# EAGLE design tablespoon-no-adc-backside (EAGLE 6.5.0)
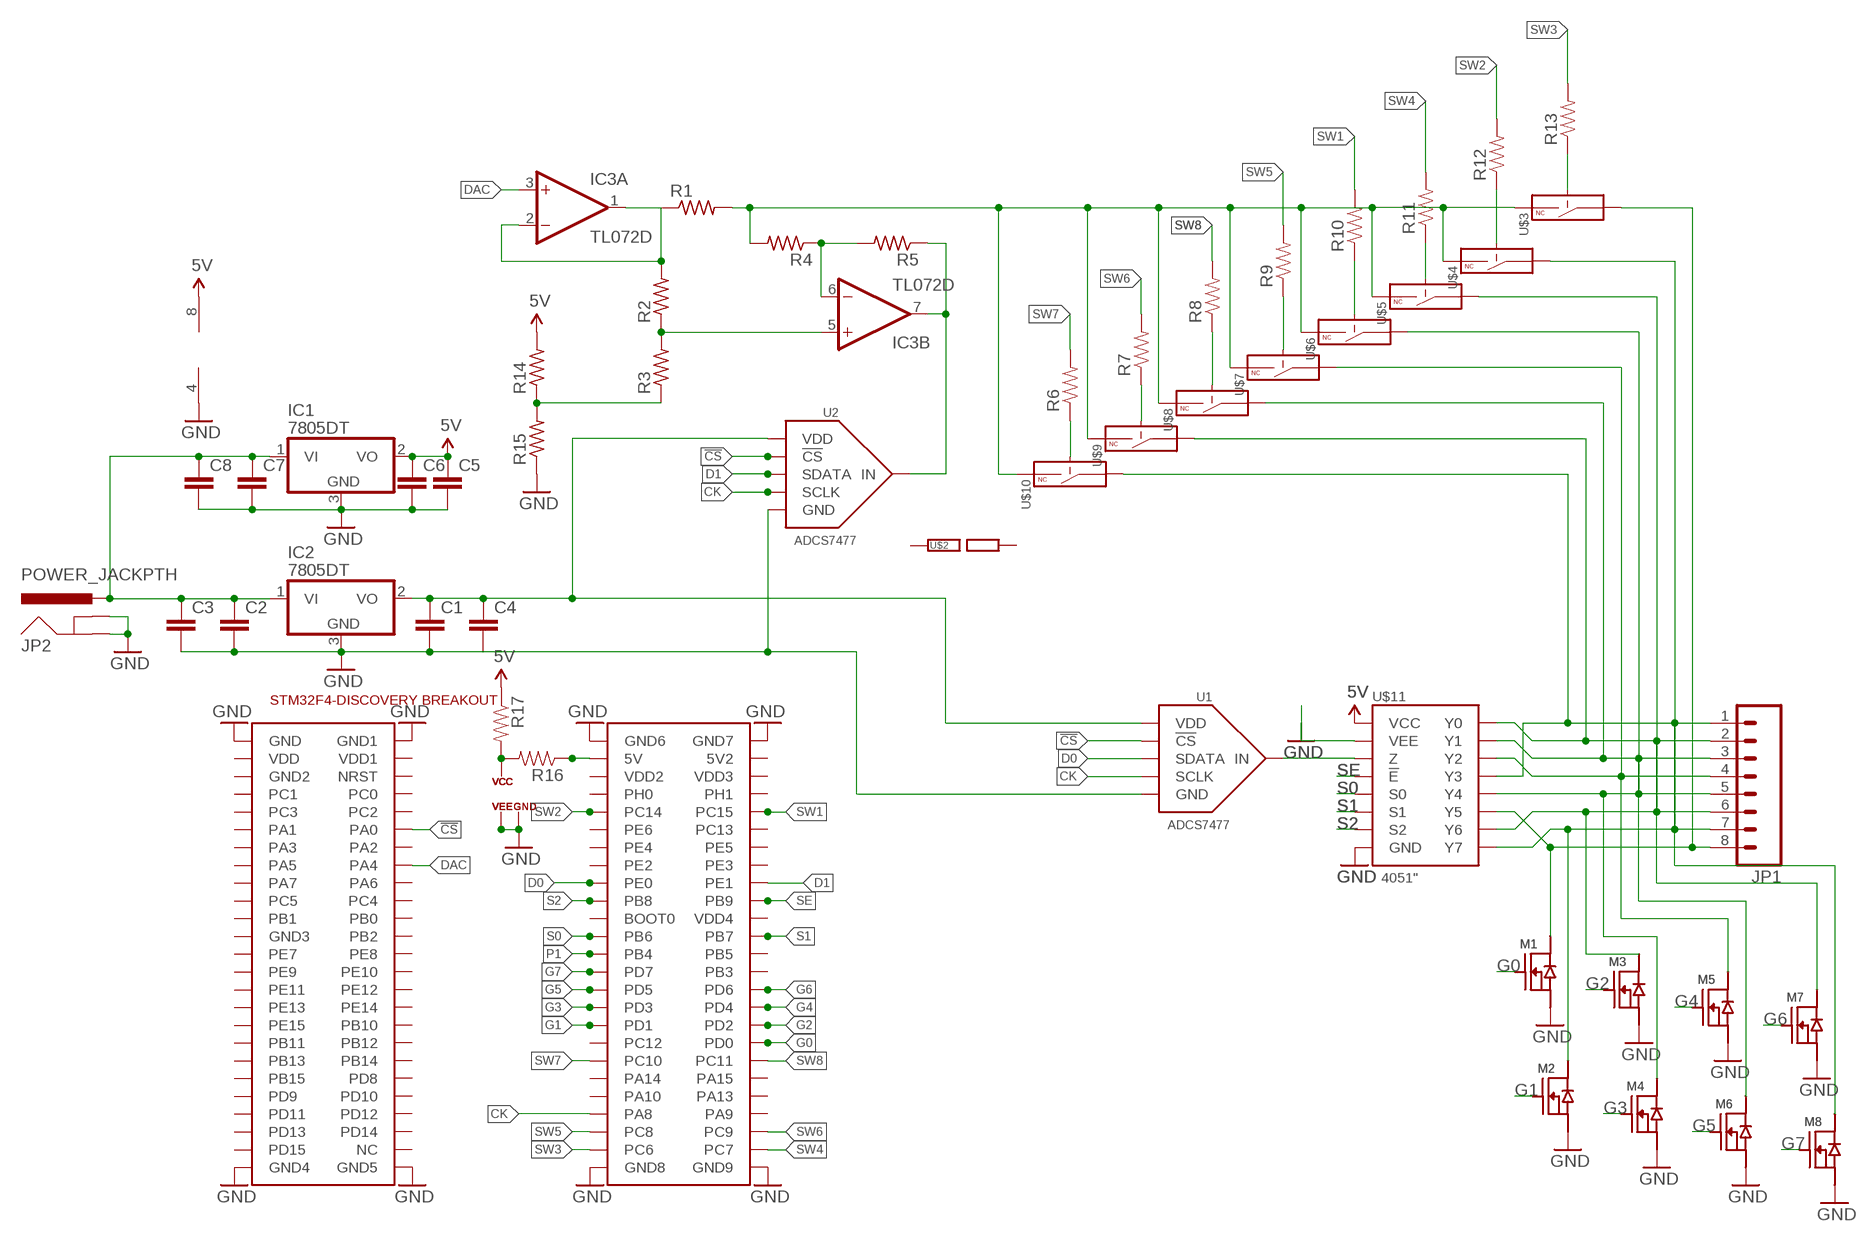
[diagram p0: schematic, sheet 1]

## Parts
C1  C-EUC0805  [C0805]
C2  C-EUC0805  [C0805]
C3  C-EUC0805  [C0805]
C4  C-EUC0805  [C0805]
C5  C-EUC0805  [C0805]
C6  C-EUC0805  [C0805]
C7  C-EUC0805  [C0805]
C8  C-EUC0805  [C0805]
IC1  7805DT  [TO252]
IC2  7805DT  [TO252]
IC3  TL072D  [SO08]
JP1  M08LONGPADS  [1X08_LONGPADS]
JP2  POWER_JACKPTH  [POWER_JACK_PTH]
M1  N-FET  [SOT23-3]
M2  N-FET  [SOT23-3]
M3  N-FET  [SOT23-3]
M4  N-FET  [SOT23-3]
M5  N-FET  [SOT23-3]
M6  N-FET  [SOT23-3]
M7  N-FET  [SOT23-3]
M8  N-FET  [SOT23-3]
R1  R-US_R0603  [R0603]
R2  R-US_R0603  [R0603]
R3  R-US_R0603  [R0603]
R4  R-US_R0603  [R0603]
R5  R-US_R0603  [R0603]
R6  RESISTOR0805-RES  [0805]
R7  RESISTOR0805-RES  [0805]
R8  RESISTOR0805-RES  [0805]
R9  RESISTOR0805-RES  [0805]
R10  RESISTOR0805-RES  [0805]
R11  RESISTOR0805-RES  [0805]
R12  RESISTOR0805-RES  [0805]
R13  RESISTOR0805-RES  [0805]
R14  R-US_R0603  [R0603]
R15  R-US_R0603  [R0603]
R16  RESISTOR0805-RES  [0805]
R17  RESISTOR0805-RES  [0805]
U1  ADCS7477  [SOT-23-6]
U2  ADCS7477  [SOT-23-6]
U$1  STM32F4-DISCOVERY  [STM32F4-DISCOVERY]
U$2  RAILSEP  [RAIL]
U$3  DG467  [TSSOP-6]
U$4  DG467  [TSSOP-6]
U$5  DG467  [TSSOP-6]
U$6  DG467  [TSSOP-6]
U$7  DG467  [TSSOP-6]
U$8  DG467  [TSSOP-6]
U$9  DG467  [TSSOP-6]
U$10  DG467  [TSSOP-6]
U$11  4051"  [TSSOP-16]

## Nets
4.6V: R16.1 U$1.P$53(5V)
5V: C5.1 C6.1 IC1.2(VO) IC3.8(P:V+) R14.2 R17.1 U$11.P$16(VCC)
!CS: U1.P$6(!CS) U2.P$6(!CS) U$1.P$12(PA0)
CK: U1.P$4(SCLK) U2.P$4(SCLK) U$1.P$93(PA8)
CUR: IC3.7(B:OUT) R5.1 U2.P$3(IN)
D0: U1.P$5(SDATA) U$1.P$67(PE0)
D1: U2.P$5(SDATA) U$1.P$68(PE1)
DAC: IC3.3(A:+IN) U$1.P$16(PA4)
G0: M1.1(G) U$1.P$86(PD0)
G1: M2.1(G) U$1.P$83(PD1)
G2: M3.1(G) U$1.P$84(PD2)
G3: M4.1(G) U$1.P$81(PD3)
G4: M5.1(G) U$1.P$82(PD4)
G5: M6.1(G) U$1.P$79(PD5)
G6: M7.1(G) U$1.P$80(PD6)
G7: M8.1(G) U$1.P$77(PD7)
GND: C1.2 C2.2 C3.2 C4.2 C5.2 C6.2 C7.2 C8.2 IC1.3(GND) IC2.3(GND) IC3.4(P:V-) JP2.GND JP2.GNDBREAK M1.2(S) M2.2(S) M3.2(S) M4.2(S) M5.2(S) M6.2(S) M7.2(S) M8.2(S) R15.1 U1.P$2(GND) U2.P$2(GND) U$1.P$1(GND) U$1.P$2(GND1) U$1.P$49(GND4) U$1.P$50(GND5) U$1.P$51(GND6) U$1.P$52(GND7) U$1.P$99(GND8) U$1.P$100(GND9) U$3.P$2(VEE) U$3.P$4(GND) U$4.P$2(VEE) U$4.P$4(GND) U$5.P$2(VEE) U$5.P$4(GND) U$6.P$2(VEE) U$6.P$4(GND) U$7.P$2(VEE) U$7.P$4(GND) U$8.P$2(VEE) U$8.P$4(GND) U$9.P$2(VEE) U$9.P$4(GND) U$10.P$2(VEE) U$10.P$4(GND) U$11.P$7(VEE) U$11.P$8(GND)
N$1: JP1.2 M7.3(D) U$9.P$6(COM) U$11.P$13(Y0)
N$2: C1.1 C4.1 IC2.2(VO) U1.P$1(VDD) U2.P$1(VDD)
N$4: R6.1 U$10.P$3(CTL)
N$5: C2.1 C3.1 C7.1 C8.1 IC1.1(VI) IC2.1(VI) JP2.PWR
N$6: JP1.3 M6.3(D) U$8.P$6(COM) U$11.P$14(Y1)
N$7: R7.1 U$9.P$3(CTL)
N$8: IC3.1(A:OUT) IC3.2(A:-IN) R1.1 R2.2
N$9: JP1.1 M8.3(D) U$10.P$6(COM) U$11.P$12(Y3)
N$13: IC3.5(B:+IN) R2.1 R3.2
N$14: IC3.6(B:-IN) R4.1 R5.2
N$15: R8.1 U$8.P$3(CTL)
N$16: R1.2 R4.2 U$3.P$1(IN) U$4.P$1(IN) U$5.P$1(IN) U$6.P$1(IN) U$7.P$1(IN) U$8.P$1(IN) U$9.P$1(IN) U$10.P$1(IN)
N$17: R9.1 U$7.P$3(CTL)
N$18: R12.1 U$4.P$3(CTL)
N$19: R13.1 U$3.P$3(CTL)
N$20: R11.1 U$5.P$3(CTL)
N$21: R10.1 U$6.P$3(CTL)
N$29: JP1.8 M1.3(D) U$3.P$6(COM) U$11.P$5(Y5)
N$35: R3.1 R14.1 R15.2
N$36: R16.2 R17.2 U$3.P$5(VCC) U$4.P$5(VCC) U$5.P$5(VCC) U$6.P$5(VCC) U$7.P$5(VCC) U$8.P$5(VCC) U$9.P$5(VCC) U$10.P$5(VCC)
N$37: U1.P$3(IN) U$11.P$3(Z)
N$38: JP1.7 M2.3(D) U$4.P$6(COM) U$11.P$4(Y7)
N$39: JP1.6 M3.3(D) U$5.P$6(COM) U$11.P$2(Y6)
N$40: JP1.5 M4.3(D) U$6.P$6(COM) U$11.P$1(Y4)
N$41: JP1.4 M5.3(D) U$7.P$6(COM) U$11.P$15(Y2)
P1: U$1.P$75(PB4)
S0: U$1.P$73(PB6) U$11.P$11(S0)
S1: U$1.P$74(PB7) U$11.P$10(S1)
S2: U$1.P$69(PB8) U$11.P$9(S2)
SE: U$1.P$70(PB9) U$11.P$6(!E)
SW1: R10.2 U$1.P$60(PC15)
SW2: R12.2 U$1.P$59(PC14)
SW3: R13.2 U$1.P$97(PC6)
SW4: R11.2 U$1.P$98(PC7)
SW5: R9.2 U$1.P$95(PC8)
SW6: R7.2 U$1.P$96(PC9)
SW7: R6.2 U$1.P$87(PC10)
SW8: R8.2 U$1.P$88(PC11)
Unconnected: U$1.P$3(VDD) U$1.P$4(VDD1) U$1.P$5(GND2) U$1.P$6(NRST) U$1.P$7(PC1) U$1.P$8(PC0) U$1.P$9(PC3) U$1.P$10(PC2) U$1.P$11(PA1) U$1.P$13(PA3) U$1.P$14(PA2) U$1.P$15(PA5) U$1.P$17(PA7) U$1.P$18(PA6) U$1.P$19(PC5) U$1.P$20(PC4) U$1.P$21(PB1) U$1.P$22(PB0) U$1.P$23(GND3) U$1.P$24(PB2) U$1.P$25(PE7) U$1.P$26(PE8) U$1.P$27(PE9) U$1.P$28(PE10) U$1.P$29(PE11) U$1.P$30(PE12) U$1.P$31(PE13) U$1.P$32(PE14) U$1.P$33(PE15) U$1.P$34(PB10) U$1.P$35(PB11) U$1.P$36(PB12) U$1.P$37(PB13) U$1.P$38(PB14) U$1.P$39(PB15) U$1.P$40(PD8) U$1.P$41(PD9) U$1.P$42(PD10) U$1.P$43(PD11) U$1.P$44(PD12) U$1.P$45(PD13) U$1.P$46(PD14) U$1.P$47(PD15) U$1.P$48(NC) U$1.P$54(5V2) U$1.P$55(VDD2) U$1.P$56(VDD3) U$1.P$57(PH0) U$1.P$58(PH1) U$1.P$61(PE6) U$1.P$62(PC13) U$1.P$63(PE4) U$1.P$64(PE5) U$1.P$65(PE2) U$1.P$66(PE3) U$1.P$71(BOOT0) U$1.P$72(VDD4) U$1.P$76(PB5) U$1.P$78(PB3) U$1.P$85(PC12) U$1.P$89(PA14) U$1.P$90(PA15) U$1.P$91(PA10) U$1.P$92(PA13) U$1.P$94(PA9) U$2.P$L(L) U$2.P$R(R)

## Library data of the parts
C1-C8 = rcl:C-EU: CAPACITOR, European symbol
IC1 IC2 = linear:78*: Positive VOLTAGE REGULATOR Source: http://cache.national.com/ds/LM/LM78L05.pdf http://www.fairchildsemi.com/ds/LM/LM7805.pdf
IC3 = linear:TL072: OP AMP
JP1 = SparkFun-Connectors:M08: Header 8 Standard 8-pin 0.1" header. Use with straight break away headers (SKU : PRT-00116), right angle break away headers (PRT-00553), swiss pins (PRT-00743), machine pins (PRT-00117), and female headers (PRT-00115).
JP2 = SparkFun-Connectors:POWER_JACK: Power Jack This is the standard 5.5mm barrel jack for power. The PTH is the most common, proven, reliable, footprint. The Slot footprint only works if the mill layer is transmitted to the PCB fab house so be warned. Mating wall wart : TOL-00298 (and others); PROD_ID: CONN-08197
M1-M8 = butter:N-FET
R1-R5 R14 R15 = rcl:R-US_: RESISTOR, American symbol
R6-R13 R16 R17 = SparkFun-Passives:RESISTOR: Resistor Basic schematic elements and footprints for 0603, 1206, and PTH resistors.
U1 U2 = butter:ADCS7477: TI ADCS7477 10 bit 1MSPS ADC 5V 10mW Digikey <http://www.digikey.com/product-detail/en/ADCS7477AIMF%2FNOPB/ADCS7477AIMF%2FNOPBTR-ND/568478>
U$1 = STM32F4-DISCOVERY:STM32F4-DISCOVERY
U$2 = butter:RAILSEP
U$3-U$10 = butter:DG467
U$11 = butter:4051: 74HC4051PW NXP 8:1 Analog Multiplexer digikey <http://www.digikey.com/product-detail/en/74HC4051PW,118/568-2259-1-ND/946721>

## Board
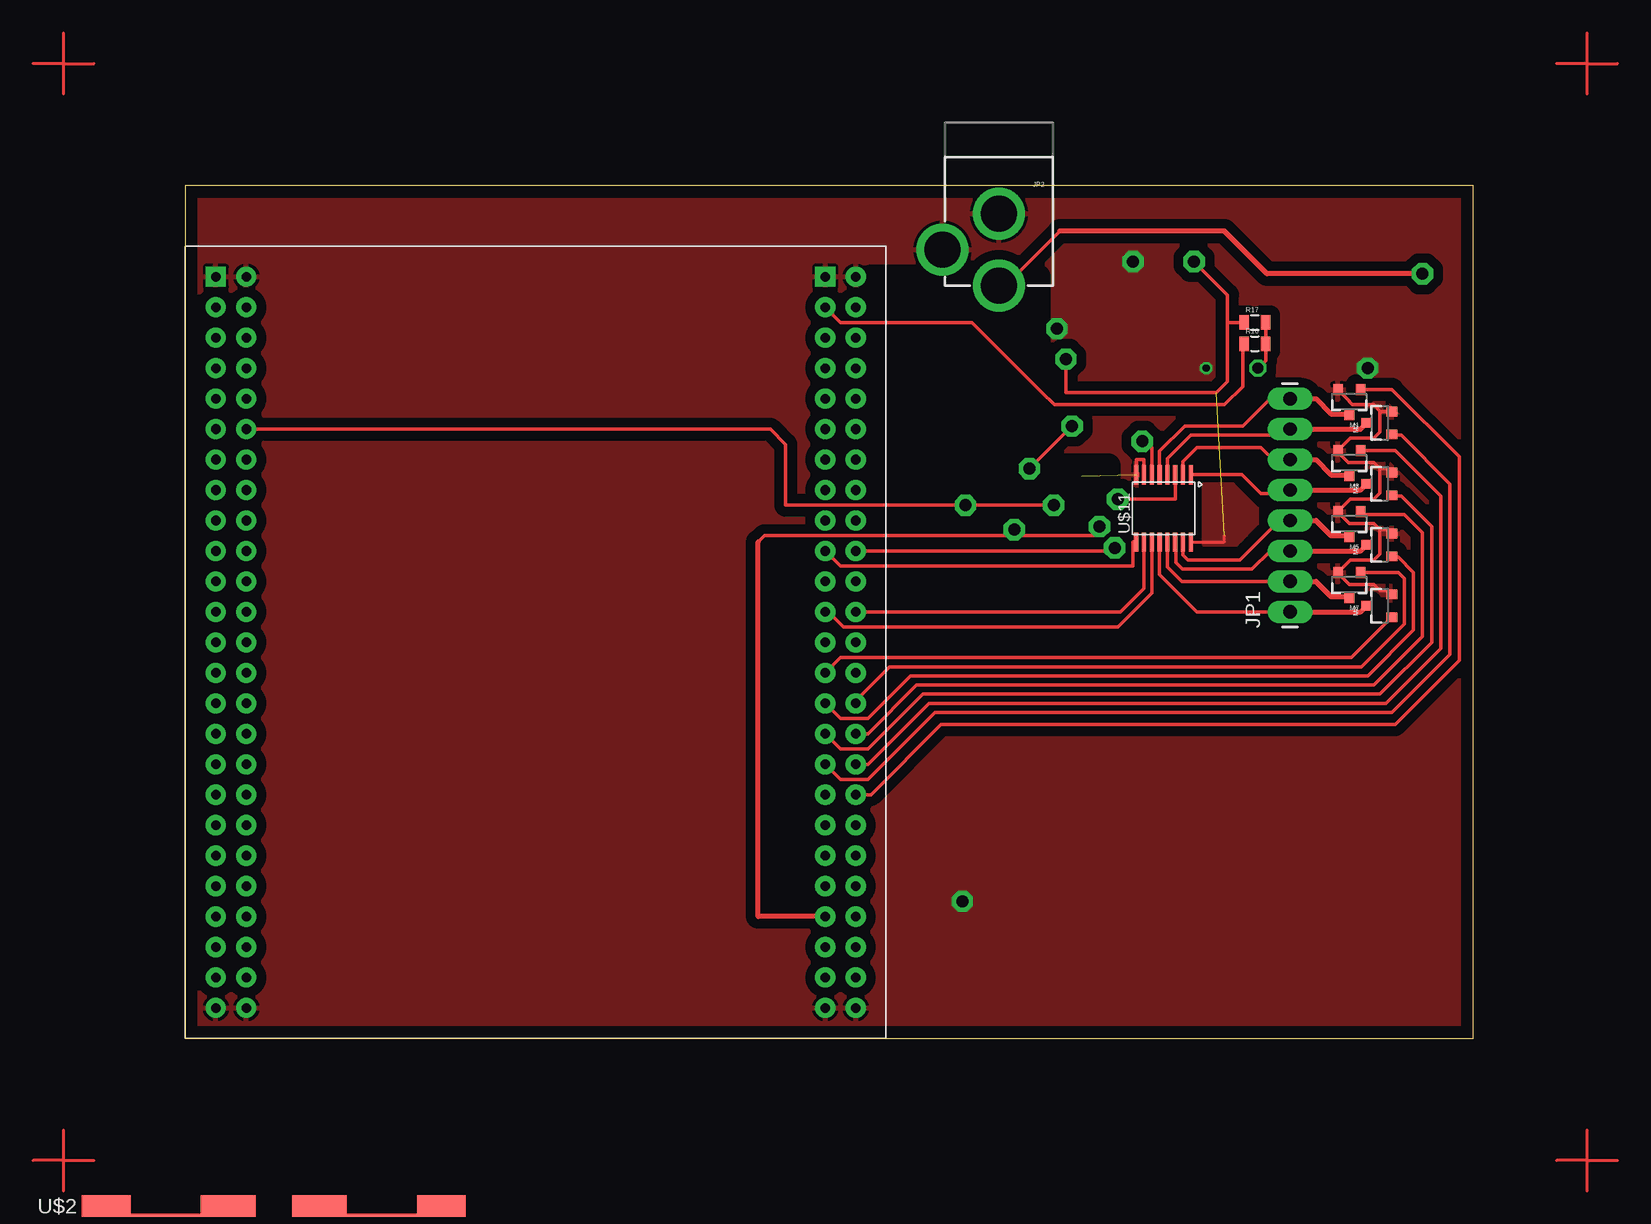
[diagram p1: board, top side]
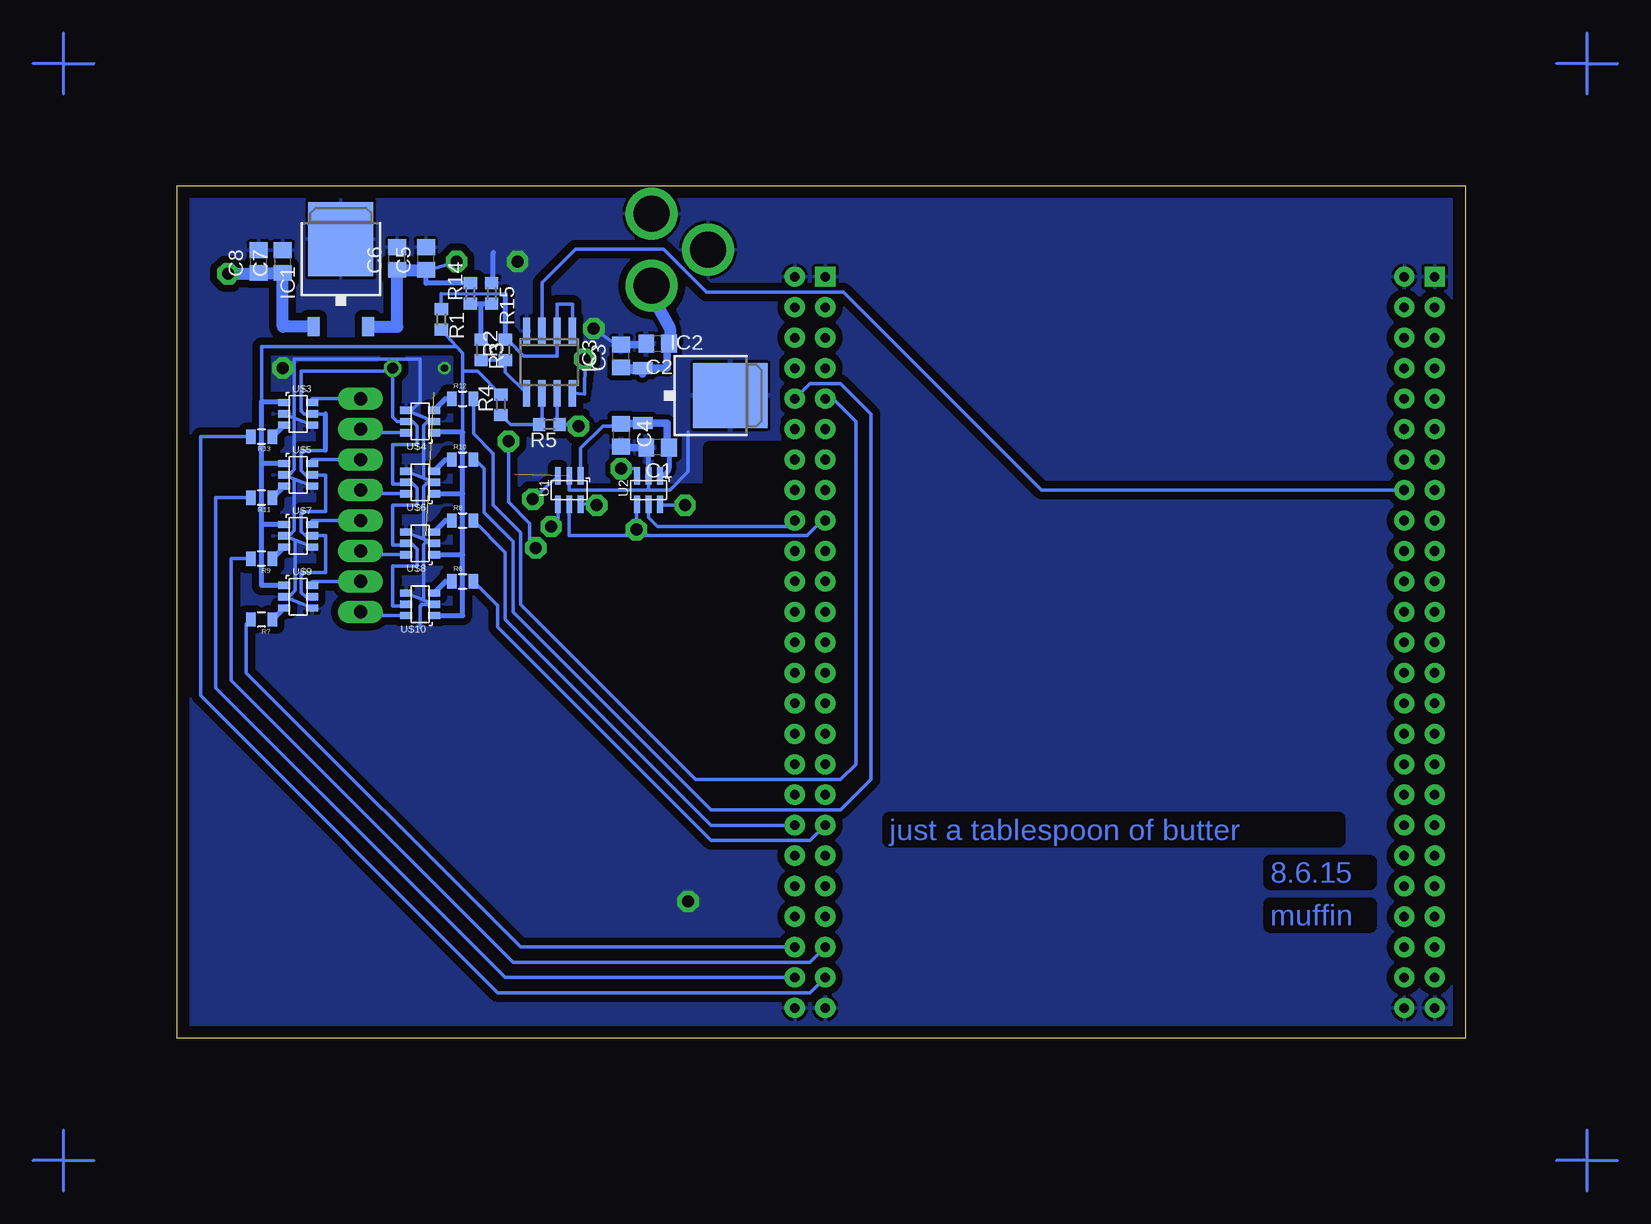
[diagram p2: board, bottom side, seen from below]

Size 107.37 x 71.11 mm. Coordinates in mm from the lower left corner, seen from the top.
Outline: 0,0 107.37,0 107.37,71.11 0,71.11 0,0
Copper layers (1*16): Top 0.035mm / dielectric 1.5mm / Bottom 0.035mm
Design rules "default": minimum track width 10mil, minimum drill 24mil, track to track 8mil, track to pad 8mil, pad to pad 8mil, via to via 8mil, smd to smd 8mil, copper to edge 40mil, drill to drill 8mil, minimum pad ring 10mil, minimum via ring 8mil, stop-mask expansion 4mil, vias tented up to drill 0mil, thermal gap 10mil
tRestrict: area 57.1,42.2 to 77,63.5
bRestrict: area 55.9,45.2 to 74.4,49.3

### Footprints (pad centres in the part's own frame; a part is rotated, then mirrored left to right if it is on the bottom)
C0805 = smd 1.3 x 1.5: 1 -0.95,0; 2 0.95,0
TO252 = smd 1 x 1.6: 1 -2.28,-4.8; 2 2.28,-4.8 | smd 5.4 x 6.2: 3 0,2.5
SO08 = smd 0.6 x 2.2: 1 -1.905,-2.6; 2 -0.635,-2.6; 3 0.635,-2.6; 4 1.905,-2.6; 5 1.905,2.6; 6 0.635,2.6; 7 -0.635,2.6; 8 -1.905,2.6
1X08_LONGPADS = drill 1.118 pad 1.88 long: 1 0,0; 2 2.54,0; 3 5.08,0; 4 7.62,0; 5 10.16,0; 6 12.7,0; 7 15.24,0; 8 17.78,0
POWER_JACK_PTH = drill 2.997 pad 4.318: GND 0,7.7; GNDBREAK 4.7,10.7; PWR 0,13.7
SOT23-3 = smd 0.8 x 0.9: 1 -0.95,-1; 2 0.95,-1; 3 0,1.1
R0603 = smd 1 x 1.1: 1 -0.85,0; 2 0.85,0
0805 = smd 0.8 x 1.2: 1 -0.9,0; 2 0.9,0
SOT-23-6 = smd 1.473 x 0.483: P$1 -1.181,0.95; P$2 -1.181,0; P$3 -1.181,-0.95; P$4 1.181,-0.95; P$5 1.181,0; P$6 1.181,0.95
STM32F4-DISCOVERY = drill 0.8 pad 1.676 square: P$1 -27.94,30.48; P$51 22.86,30.48 | drill 0.8 pad 1.676: P$2 -25.4,30.48; P$3 -27.94,27.94; P$4 -25.4,27.94; P$5 -27.94,25.4; P$6 -25.4,25.4; P$7 -27.94,22.86; P$8 -25.4,22.86; P$9 -27.94,20.32; P$10 -25.4,20.32; P$11 -27.94,17.78; P$12 -25.4,17.78; P$13 -27.94,15.24; P$14 -25.4,15.24; P$15 -27.94,12.7; P$16 -25.4,12.7; P$17 -27.94,10.16; P$18 -25.4,10.16; P$19 -27.94,7.62; P$20 -25.4,7.62; P$21 -27.94,5.08; P$22 -25.4,5.08; P$23 -27.94,2.54; P$24 -25.4,2.54; P$25 -27.94,0; P$26 -25.4,0; P$27 -27.94,-2.54; P$28 -25.4,-2.54; P$29 -27.94,-5.08; P$30 -25.4,-5.08; P$31 -27.94,-7.62; P$32 -25.4,-7.62; P$33 -27.94,-10.16; P$34 -25.4,-10.16; P$35 -27.94,-12.7; P$36 -25.4,-12.7; P$37 -27.94,-15.24; P$38 -25.4,-15.24; P$39 -27.94,-17.78; P$40 -25.4,-17.78; P$41 -27.94,-20.32; P$42 -25.4,-20.32; P$43 -27.94,-22.86; P$44 -25.4,-22.86; P$45 -27.94,-25.4; P$46 -25.4,-25.4; P$47 -27.94,-27.94; P$48 -25.4,-27.94; P$49 -27.94,-30.48; P$50 -25.4,-30.48; P$52 25.4,30.48; P$53 22.86,27.94; P$54 25.4,27.94; P$55 22.86,25.4; P$56 25.4,25.4; P$57 22.86,22.86; P$58 25.4,22.86; P$59 22.86,20.32; P$60 25.4,20.32; P$61 22.86,17.78; P$62 25.4,17.78; P$63 22.86,15.24; P$64 25.4,15.24; P$65 22.86,12.7; P$66 25.4,12.7; P$67 22.86,10.16; P$68 25.4,10.16; P$69 22.86,7.62; P$70 25.4,7.62; P$71 22.86,5.08; P$72 25.4,5.08; P$73 22.86,2.54; P$74 25.4,2.54; P$75 22.86,0; P$76 25.4,0; P$77 22.86,-2.54; P$78 25.4,-2.54; P$79 22.86,-5.08; P$80 25.4,-5.08; P$81 22.86,-7.62; P$82 25.4,-7.62; P$83 22.86,-10.16; P$84 25.4,-10.16; P$85 22.86,-12.7; P$86 25.4,-12.7; P$87 22.86,-15.24; P$88 25.4,-15.24; P$89 22.86,-17.78; P$90 25.4,-17.78; P$91 22.86,-20.32; P$92 25.4,-20.32; P$93 22.86,-22.86; P$94 25.4,-22.86; P$95 22.86,-25.4; P$96 25.4,-25.4; P$97 22.86,-27.94; P$98 25.4,-27.94; P$99 22.86,-30.48; P$100 25.4,-30.48
RAIL = smd 14.478 x 0.254: P$1 -8.763,-0.762; P$2 8.763,-0.762 | smd 4.572 x 1.778: P$3 -3.81,0; P$4 3.81,0 | smd 4.064 x 1.778: P$L -13.97,0; P$R 13.97,0
TSSOP-6 = smd 0.991 x 0.61: P$1 -1.161,0.94; P$2 -1.161,0; P$3 -1.161,-0.94; P$4 1.161,-0.94; P$5 1.161,0; P$6 1.161,0.94
TSSOP-16 = smd 1.6 x 0.35: P$1 -2.8,2.275; P$2 -2.8,1.625; P$3 -2.8,0.975; P$4 -2.8,0.325; P$5 -2.8,-0.325; P$6 -2.8,-0.975; P$7 -2.8,-1.625; P$8 -2.8,-2.275; P$9 2.8,-2.275; P$10 2.8,-1.625; P$11 2.8,-0.975; P$12 2.8,-0.325; P$13 2.8,0.325; P$14 2.8,0.975; P$15 2.8,1.625; P$16 2.8,2.275

### Placement (x,y rotation side)
C1  67.31,49.28 180 bottom
C2  67.31,57.91 180 bottom
C3  70.36,56.9 90 bottom
C4  70.36,50.29 270 bottom
C5  86.61,65.02 90 bottom
C6  89.03,65.02 90 bottom
C7  98.55,64.77 90 bottom
C8  100.58,64.77 90 bottom
IC1  93.73,64.14 0 bottom
IC2  63.75,53.59 270 bottom
IC3  76.33,56.39 180 bottom
JP1  92.08,35.56 90 top
JP2  67.82,76.45 180 top
M1  97.03,53.09 180 top
M2  99.57,51.31 90 top
M3  97.03,48.01 180 top
M4  99.57,46.23 90 top
M5  97.03,42.93 180 top
M6  99.57,41.15 90 top
M7  97.03,37.85 180 top
M8  99.57,36.07 90 top
R1  85.34,59.94 270 bottom
R2  80.01,57.4 90 bottom
R3  82.04,57.4 270 bottom
R4  80.39,52.83 90 bottom
R5  76.33,51.18 180 bottom
R6  83.57,38.1 0 bottom
R7  100.33,34.92 180 bottom
R8  83.57,43.18 0 bottom
R9  100.33,40.01 180 bottom
R10  83.57,48.26 0 bottom
R11  100.33,45.09 180 bottom
R12  83.57,53.34 0 bottom
R13  100.33,50.16 180 bottom
R14  82.93,62.1 90 bottom
R15  81.15,62.1 270 bottom
R16  89.15,57.91 0 top
R17  89.15,59.69 0 top
U1  74.68,45.72 270 bottom
U2  68.07,45.72 270 bottom
U$1  30.48,33.02 0 top
U$2  7.37,-13.97 0 top  (outside the outline)
U$3  97.28,52.07 0 bottom
U$4  87.12,51.44 180 bottom
U$5  97.28,46.99 0 bottom
U$6  87.12,46.35 180 bottom
U$7  97.28,41.91 0 bottom
U$8  87.12,41.27 180 bottom
U$9  97.28,36.83 0 bottom
U$10  87.12,36.2 180 bottom
U$11  81.53,44.2 270 top

### Tracks (layer width: path | path; a pad name or v marks a point on that pad's centre or on a via)
4.6V
  Top 0.305: U$1.P$53 54.61,59.69 65.58,59.69 71.37,53.89 72.43,52.83 86.61,52.83 88.14,54.36 88.14,57.29 R16.1
5V  (via drill 1 pad 1.78)  (1 unrouted)
  Top 0.254: U$11.P$16 86.61,41.4 86.61,41.91
  Top 0.305: v73.41,56.64 73.41,53.85 85.95,53.85 86.87,54.76 86.87,59.69 | 86.87,59.69 86.87,61.98 v84.07,64.77 | R17.1 86.87,59.69
  Bottom 0.305: IC3.8 73.41,53.73 73.35,56.58 v73.41,56.64 | v84.07,64.77 86.55,64.01 C5.1
  Bottom 0.406: R14.2 86.61,62.95 C5.1
  Bottom 1.016: IC1.2 89.03,59.34 C6.1 C5.1
  pour Top: 84.84,41.15 87.63,41.15 89.41,42.93 89.41,44.2 87.38,46.23 84.84,46.23
!CS  (via drill 1 pad 1.78)
  Top 0.305: U$1.P$12 48.77,50.8 50.04,49.53 50.04,44.45 v65.02,44.45 v72.39,44.45
  Bottom 0.305: v72.39,44.45 72.48,44.54 U1.P$6 | U2.P$6 67.03,44.45 v65.02,44.45
CK  (via drill 1 pad 1.78)
  Top 0.305: 47.75,41.4 48.26,41.91 69.09,41.91 | 69.09,41.91 75.95,41.91 v76.2,42.67 | 69.09,41.91 v69.09,42.42
  Top 0.406: U$1.P$93 47.75,10.16 47.75,41.4
  Bottom 0.305: v76.2,42.67 75.63,42.99 U1.P$4 | U2.P$4 69.09,44.47 v69.09,42.42 69.09,41.91
CUR  (via drill 1 pad 1.78)
  Top 0.305: v70.36,47.5 v73.91,51.05
  Bottom 0.305: IC3.7 75.69,51.4 R5.1 74.04,51.18 v73.91,51.05 | U2.P$3 69.02,47.5 v70.36,47.5
D0
  Bottom 0.305: U$1.P$67 53.59,43.18 54.86,41.91 74.68,41.91 U1.P$5
D1
  Bottom 0.305: U$1.P$68 56.39,42.67 67.31,42.67 68.07,43.43 U2.P$5
DAC
  Bottom 0.305: U$1.P$16 35.31,45.72 51.82,62.23 63.25,62.23 66.8,65.79 74.17,65.79 76.96,62.99 IC3.3
G0
  Top 0.305: U$1.P$86 57.15,20.32 62.99,26.16 100.84,26.16 106.17,31.5 106.17,48.51 100.58,54.1 97.99,54.1 M1.1
G1
  Top 0.305: U$1.P$83 54.61,21.59 56.9,21.59 62.48,27.18 100.58,27.18 105.41,32 105.41,46.23 101.35,50.29 100.63,50.29 M2.1
G2
  Top 0.305: U$1.P$84 56.9,22.86 61.98,27.94 100.08,27.94 104.65,32.51 104.65,45.21 100.84,49.02 97.99,49.02 M3.1
G3
  Top 0.305: U$1.P$81 54.61,24.13 56.9,24.13 61.47,28.7 99.57,28.7 103.89,33.02 103.89,42.67 101.35,45.21 100.63,45.21 M4.1
G4
  Top 0.305: U$1.P$82 56.9,25.4 60.96,29.46 99.06,29.46 103.12,33.53 103.12,42.16 101.6,43.69 98.22,43.69 M5.1
G5
  Top 0.305: U$1.P$79 54.61,26.67 56.9,26.67 60.45,30.23 98.55,30.23 102.36,34.04 102.36,38.86 101.09,40.13 100.63,40.13 M6.1
G6
  Top 0.305: U$1.P$80 55.88,28.19 58.67,30.99 98.04,30.99 101.6,34.54 101.6,38.35 101.09,38.86 97.99,38.86 M7.1
G7
  Top 0.305: U$1.P$77 54.61,31.75 97.2,31.75 M8.1
GND  (via drill 0.6, 1 pad 1.78)  (1 unrouted)
  Top 0.305: M3.2 97.11,50.04 99.06,50.04 99.57,50.55 99.57,52.32 | 99.57,52.32 99.63,52.26 M2.2 | M4.2 100.25,47.5 99.57,47.5 | 99.57,47.5 99.06,48.01 96.94,48.01 96.08,48.87 | 99.57,47.5 99.57,45.47 99.06,44.96 97.11,44.96 M5.2 96.08,43.88 97.03,42.93 99.06,42.93 99.57,42.42 | 99.57,42.42 99.57,40.39 99.06,39.88 97.11,39.88 M7.2 96.08,38.8 97.03,37.85 99.06,37.85 99.57,37.34 100.25,37.34 M8.2 | 99.57,42.42 100.33,42.42 100.57,42.18 M6.2 | M1.2 97.03,53.14 97.03,53.09 97.28,52.83 99.06,52.83 99.57,52.32 | U$11.P$7 79.91,48.26 79.26,48.26 U$11.P$8
  Top 0.406: 96.08,48.87 M3.2
  Bottom 0.305: 86.83,36.55 U$10.P$2 87,36.2 87.12,36.07 87.12,34.29 | 86.83,36.55 U$10.P$4 | 86.83,41.63 U$8.P$2 85.96,41.15 86.61,41.4 86.83,41.19 86.83,36.55 | 86.83,41.63 U$8.P$4 | 86.83,46.71 U$6.P$2 86.09,46.23 86.36,46.48 86.83,46.01 86.83,41.63 | 86.83,46.71 U$6.P$4 | U$3.P$4 97.62,51.74 | 97.62,51.74 U$3.P$2 | U$5.P$4 97.62,46.66 | 97.62,46.66 U$5.P$2 98.04,46.99 97.62,47.42 97.62,51.74 | U$7.P$4 97.31,41.45 | 97.31,41.45 U$7.P$2 98.04,41.91 97.62,42.34 97.62,46.66 | U$9.P$4 U$9.P$2 98.04,36.83 97.54,37.34 97.54,41.45 97.31,41.45 | 86.83,46.71 86.83,51.09 86.36,51.56 86.09,51.31 U$4.P$2 U$4.P$4 87.81,52.38 87.12,53.06 87.12,56.64 97.62,56.64 97.62,51.74 | C3.2 70.8,57.85 v72.64,59.18 | 68.07,45.72 74.68,45.72 U1.P$2 | 68.07,45.72 U2.P$2 | 68.07,45.72 66.29,45.72 64.77,47.24 64.77,50.55
  Bottom 0.406: C1.2 arc90 68.07,49.09 U2.P$2 | R15.1 81.03,62.95 81.03,65.53
  Bottom 0.61: C1.2 70.36,49.28 C4.2 | C3.2 68.26,57.85 C2.2
  other vias: 85.09,55.88 98.55,55.88 78.99,64.77 64.77,11.43
  pour Bottom (isolate 0.406): 57.15,48.59 57.4,57.35 59.75,59.69 71.63,59.69 71.88,59.44 73.66,46.23 57.23,46.48
  pour Bottom (isolate 0.61): 0,71.12 107.44,71.12 107.44,0 0,0
  pour Top (isolate 0.813): 0,71.12 0,0 107.44,0 107.44,71.12
N$1
  Top 0.305: U$11.P$13 81.86,39.31 83.07,38.1 92.71,38.1
  Top 0.406: JP1.2 92.71,38.1 94.23,38.1 95.5,36.83 96.94,36.83 M7.3
  Bottom 0.305: JP1.2 96.12,38.1 U$9.P$6
N$2
  Bottom 0.305: 70.36,51.31 C4.1 70.55,51.05 71.88,51.05 73.73,49.21 U1.P$1
  Bottom 0.406: C1.1 66.36,47.66 arc90 U2.P$1
  Bottom 0.61: C1.1 66.55,49.28 66.55,51.31 IC2.2 68.55,51.24 C4.1
N$3
  Bottom 0.254: 116.84,78.74 116.84,81.28 | 116.84,81.28 116.84,83.82 | 116.84,81.28 114.3,81.28 | 116.84,81.28 119.38,81.28
N$4
  Bottom 0.406: U$10.P$3 85,38.1 R6.1
N$5  (via drill 1 pad 1.78)
  Top 0.305: 72.9,67.31 68.34,62.75 JP2.PWR
  Top 0.406: v103.12,63.75 90.17,63.75 86.61,67.31 72.9,67.31
  Bottom 0.305: 100.9,63.75 C8.1 | 70.36,55.87 70.36,55.63 68.58,55.37 | 68.07,62.48 67.82,62.23
  Bottom 0.61: C2.1 66.55,57.91 66.55,55.88 IC2.1 70.36,55.87 C3.1 68.58,55.88 68.58,55.37
  Bottom 1.016: C8.1 C7.1 98.55,59.34 IC1.1 | v103.12,63.75 100.9,63.75 | JP2.PWR 67.82,62.23 67.82,61.98 66.29,59.18 66.29,58.17 66.11,58.17 C2.1
N$6
  Top 0.305: U$11.P$14 82.55,41.35 82.55,39.68 83.12,39.12 88.9,39.12 90.42,40.64 JP1.3
  Top 0.406: JP1.3 97.96,40.64 M6.3
  Bottom 0.305: U$8.P$6 92.08,40.34 JP1.3
N$7
  Bottom 0.406: U$9.P$3 99.41,34.92 R7.1
N$8
  Bottom 0.305: R1.1 85.34,62.1 80.01,62.06 R2.2 | IC3.1 74.42,61.21 75.69,61.21 IC3.2 75.69,56.9 78.49,56.9 79.76,58.17 80.01,58.17
  Bottom 0.406: 80.01,62.06 80.01,58.17
N$9
  Top 0.305: U$11.P$12 81.21,38.67 84.32,35.56 JP1.1
  Top 0.406: JP1.1 97.96,35.56 M8.3
  Bottom 0.305: U$10.P$6 92.08,35.26 JP1.1
N$13
  Bottom 0.305: IC3.5 80.01,55.57 R2.1 R3.2
N$14
  Bottom 0.305: R4.1 79.59,51.18 R5.2 76.96,51.4 IC3.6
N$15
  Bottom 0.406: U$8.P$3 85,43.18 R8.1
N$16
  Bottom 0.305: 83.57,50.55 83.57,55.63 | 83.57,55.63 83.57,57.15 84.07,57.66 | 84.07,57.66 100.33,57.66 100.33,53.09 | 84.07,57.66 R1.2 | R4.2 82.33,55.63 83.57,55.63
  Bottom 0.406: U$9.P$1 100.33,37.77 100.33,42.85 | 100.33,42.85 100.33,47.93 | 100.33,47.93 100.33,53.09 98.44,53.09 U$3.P$1 | U$5.P$1 100.33,47.93 | U$7.P$1 100.33,42.85 | U$10.P$1 83.57,35.26 83.57,40.34 | 83.57,40.34 83.57,45.41 | 83.57,45.41 83.57,50.55 85.96,50.55 U$4.P$1 | U$6.P$1 83.57,45.41 | U$8.P$1 83.57,40.34
N$17
  Bottom 0.406: U$7.P$3 99.41,40.01 R9.1
N$18
  Bottom 0.406: U$4.P$3 85,53.34 R12.1
N$19
  Bottom 0.406: U$3.P$3 99.41,50.16 R13.1
N$20
  Bottom 0.406: U$5.P$3 99.41,45.09 R11.1
N$21
  Bottom 0.406: U$6.P$3 85,48.26 R10.1
N$22
  Bottom 0.254: -10.16,-12.7 -10.16,-10.16 | -10.16,-10.16 -10.16,-7.62 | -10.16,-10.16 -12.7,-10.16 | -10.16,-10.16 -7.62,-10.16
N$23
  Top 0.254: -10.16,-12.7 -10.16,-10.16 | -10.16,-10.16 -10.16,-7.62 | -10.16,-10.16 -12.7,-10.16 | -10.16,-10.16 -7.62,-10.16
N$25
  Bottom 0.254: 116.84,-12.7 116.84,-10.16 | 116.84,-10.16 116.84,-7.62 | 116.84,-10.16 114.3,-10.16 | 116.84,-10.16 119.38,-10.16
N$26
  Bottom 0.254: 116.84,-12.7 116.84,-10.16 | 116.84,-10.16 116.84,-7.62 | 116.84,-10.16 114.3,-10.16 | 116.84,-10.16 119.38,-10.16
N$29
  Top 0.305: U$11.P$5 81.21,48.95 83.31,51.05 88.14,51.05 90.42,53.34 JP1.8
  Top 0.406: JP1.8 94.23,53.34 95.5,52.07 96.94,52.07 M1.3
  Bottom 0.305: JP1.8 96.12,53.34 U$3.P$6
N$30
  Top 0.254: 116.84,-12.7 116.84,-10.16 | 116.84,-10.16 116.84,-7.62 | 116.84,-10.16 114.3,-10.16 | 116.84,-10.16 119.38,-10.16
N$31
  Bottom 0.254: 116.84,78.74 116.84,81.28 | 116.84,81.28 116.84,83.82 | 116.84,81.28 114.3,81.28 | 116.84,81.28 119.38,81.28
N$32
  Top 0.254: 116.84,78.74 116.84,81.28 | 116.84,81.28 116.84,83.82 | 116.84,81.28 114.3,81.28 | 116.84,81.28 119.38,81.28
N$33
  Bottom 0.254: -10.16,78.74 -10.16,81.28 | -10.16,81.28 -10.16,83.82 | -10.16,81.28 -12.7,81.28 | -10.16,81.28 -7.62,81.28
N$34
  Top 0.254: -10.16,78.74 -10.16,81.28 | -10.16,81.28 -10.16,83.82 | -10.16,81.28 -12.7,81.28 | -10.16,81.28 -7.62,81.28
N$35
  Bottom 0.406: R14.1 R15.2 82.04,61.25 R3.1
N$36  (via drill 0.9 pad 1.42)
  Top 0.305: v89.41,55.88 90.05,56.53 R16.2 R17.2
  Bottom 0.305: U$10.P$5 88.28,36.07 89.41,36.07 89.41,39.37 87.38,39.37 87.38,40.82 87.83,41.27 U$8.P$5 88.28,41.15 89.41,41.15 89.41,44.45 87.38,44.45 87.38,45.9 87.83,46.35 U$6.P$5 88.28,46.23 89.41,46.23 89.41,49.53 87.38,49.53 87.38,51.05 87.76,51.44 U$4.P$5 89.03,51.44 89.41,51.82 89.41,55.63 | U$9.P$5 96.67,36.83 97.03,37.19 97.03,38.86 95,38.86 95,41.91 U$7.P$5 96.67,41.91 97.03,42.27 97.03,43.94 95,43.94 95,46.99 U$5.P$5 96.67,46.99 97.03,47.35 97.03,49.02 95,49.02 | 95,52.07 U$3.P$5 96.77,52.07 97.03,52.32 97.03,55.63 89.41,55.63 | 89.41,55.63 v89.41,55.88
  Bottom 0.406: 95,49.02 95,52.07
N$37  (via drill 1 pad 1.78)
  Top 0.305: U$11.P$3 82.51,44.96 v77.72,44.96
  Bottom 0.305: U1.P$3 75.79,46.74 v77.72,44.96
N$38
  Top 0.305: U$11.P$4 81.86,48.33 83.82,50.29 91.57,50.29 JP1.7
  Top 0.406: JP1.7 97.96,50.8 M2.3
  Bottom 0.305: U$4.P$6 92.08,50.49 JP1.7
N$39
  Top 0.305: U$11.P$2 83.16,48.11 84.33,49.28 89.66,49.28 90.93,48.01 91.82,48.01 JP1.6
  Top 0.406: JP1.6 94.23,48.26 95.5,46.99 96.94,46.99 M3.3
  Bottom 0.305: JP1.6 96.12,48.26 U$5.P$6
N$40
  Top 0.305: U$11.P$1 88.08,47 89.66,45.41 91.77,45.41 JP1.5
  Top 0.406: JP1.5 97.96,45.72 M4.3
  Bottom 0.305: U$6.P$6 92.08,45.41 JP1.5
N$41
  Top 0.305: U$11.P$15 83.16,40.28 83.57,39.88 87.88,39.88 91.19,43.18 JP1.4
  Top 0.406: JP1.4 94.23,43.18 95.5,41.91 96.94,41.91 M5.3
  Bottom 0.305: JP1.4 96.12,43.18 U$7.P$6
S0
  Top 0.305: U$1.P$73 53.59,35.56 54.86,34.29 77.72,34.29 80.56,37.12 U$11.P$11
S1
  Top 0.305: U$1.P$74 77.95,35.56 79.91,37.52 U$11.P$10
S2
  Top 0.305: U$1.P$69 54.61,39.37 78.99,39.37 78.99,41.4 U$11.P$9
SE  (via drill 1 pad 1.78)
  Top 0.305: U$1.P$70 77.47,40.64 v77.47,40.89 | v79.76,49.78 80.56,49.28 U$11.P$6
  Bottom 0.305: v77.47,40.89 77.98,41.4 77.98,42.93 79.76,44.7 v79.76,49.78
SW1
  Bottom 0.305: U$1.P$60 54.61,54.61 52.07,54.61 49.53,52.07 49.53,21.59 52.07,19.05 62.87,19.05 79.38,35.56 79.38,41.41 81.79,43.83 81.79,47.5 82.55,48.26 R10.2
SW2
  Bottom 0.305: U$1.P$59 52.7,53.34 50.8,51.44 50.8,22.86 52.07,21.59 64.14,21.59 78.74,36.2 78.74,42.16 81.03,44.45 81.03,48.77 82.67,50.41 R12.2
SW3
  Bottom 0.305: R13.2 105.41,50.16 105.41,28.57 80.64,3.81 54.61,3.81 U$1.P$97
SW4
  Bottom 0.305: U$1.P$98 80.01,5.08 104.14,29.21 104.14,45.09 R11.2
SW5
  Bottom 0.305: R9.2 102.87,40.01 102.87,29.84 79.38,6.35 54.61,6.35 U$1.P$95
SW6
  Bottom 0.305: R7.2 101.6,34.55 101.6,30.48 78.74,7.62 U$1.P$96
SW7
  Bottom 0.305: U$1.P$87 54.61,16.51 62.87,16.51 80.64,34.29 80.64,36.08 R6.2
SW8
  Bottom 0.305: R8.2 80.01,40.52 80.01,34.92 62.87,17.78 U$1.P$88

### Text on the board
Bottom: just a tablespoon of butter | 8.6.15 | muffin